# EAGLE schematic untitled (EAGLE 7.2.0)
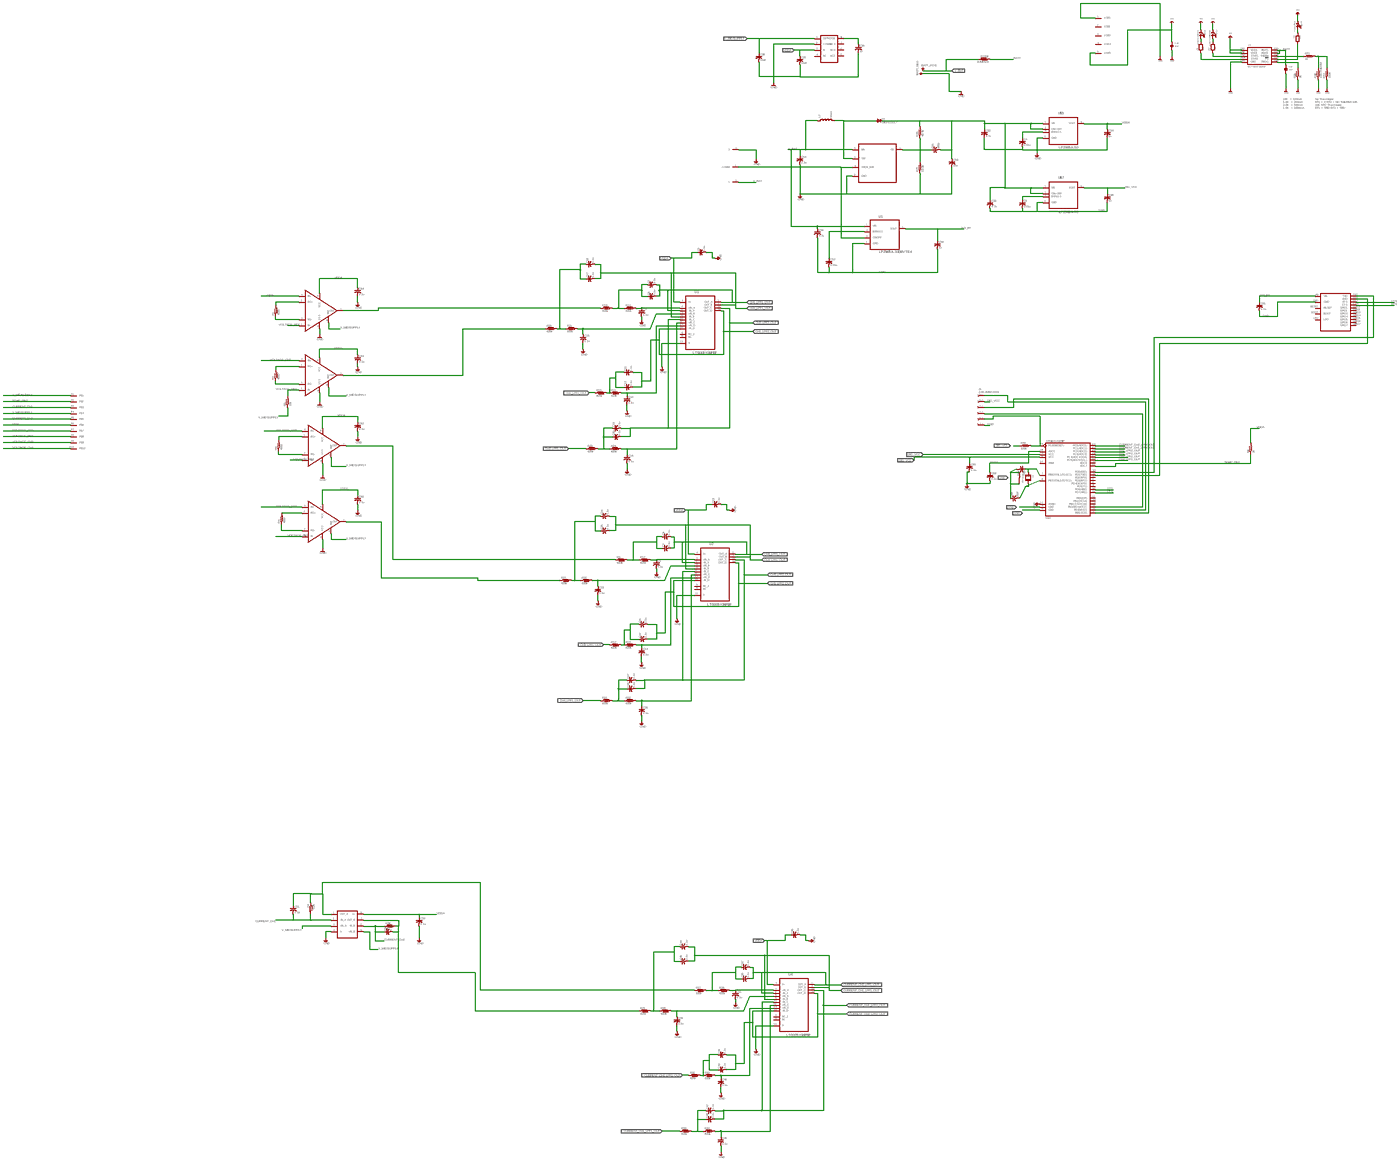
[diagram p0: schematic, sheet 1, overview]
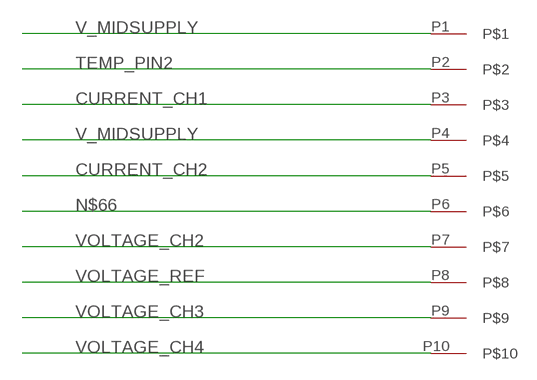
[diagram p1: schematic, sheet 1, part 1 of 7]
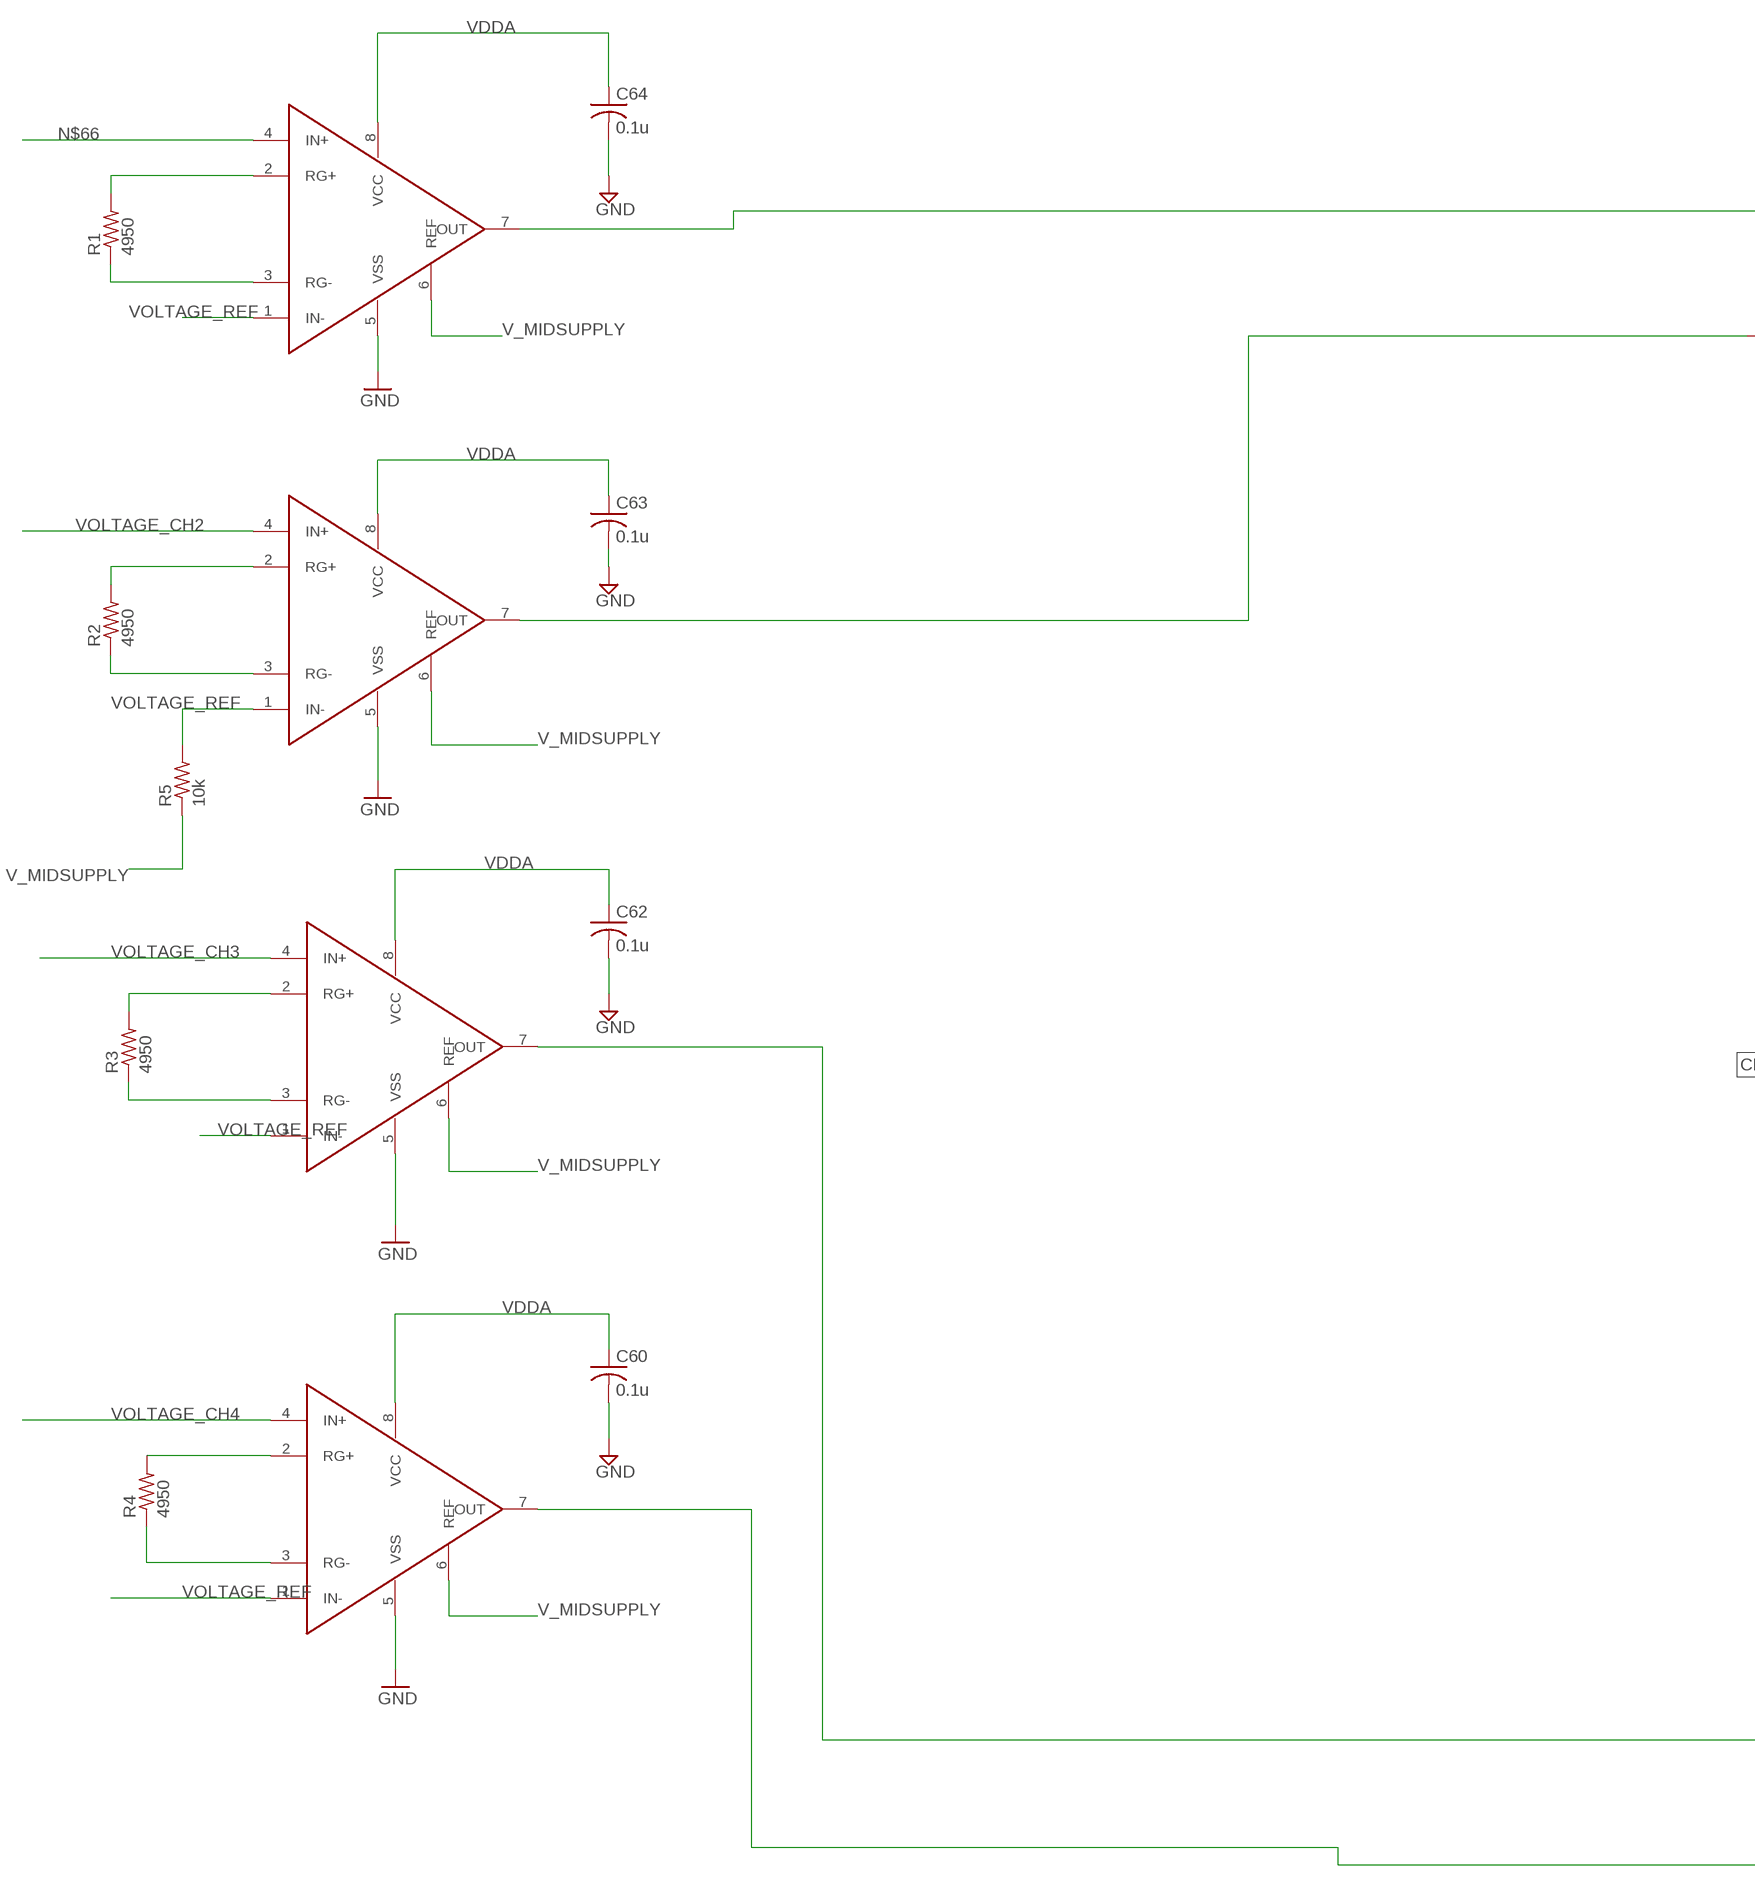
[diagram p2: schematic, sheet 1, part 2 of 7]
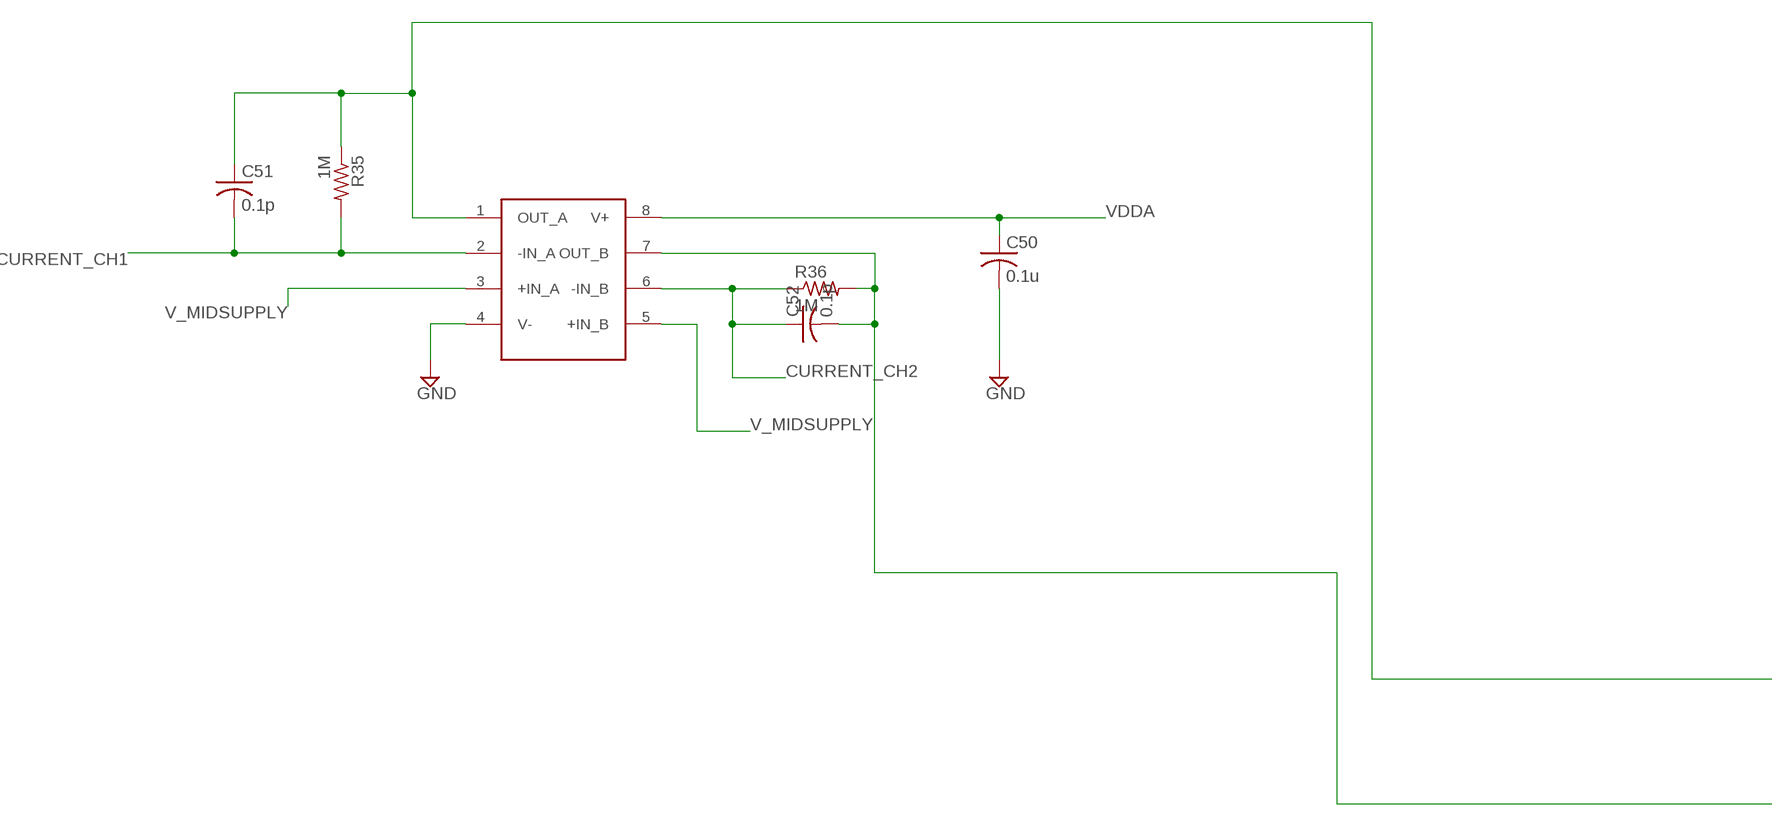
[diagram p3: schematic, sheet 1, part 3 of 7]
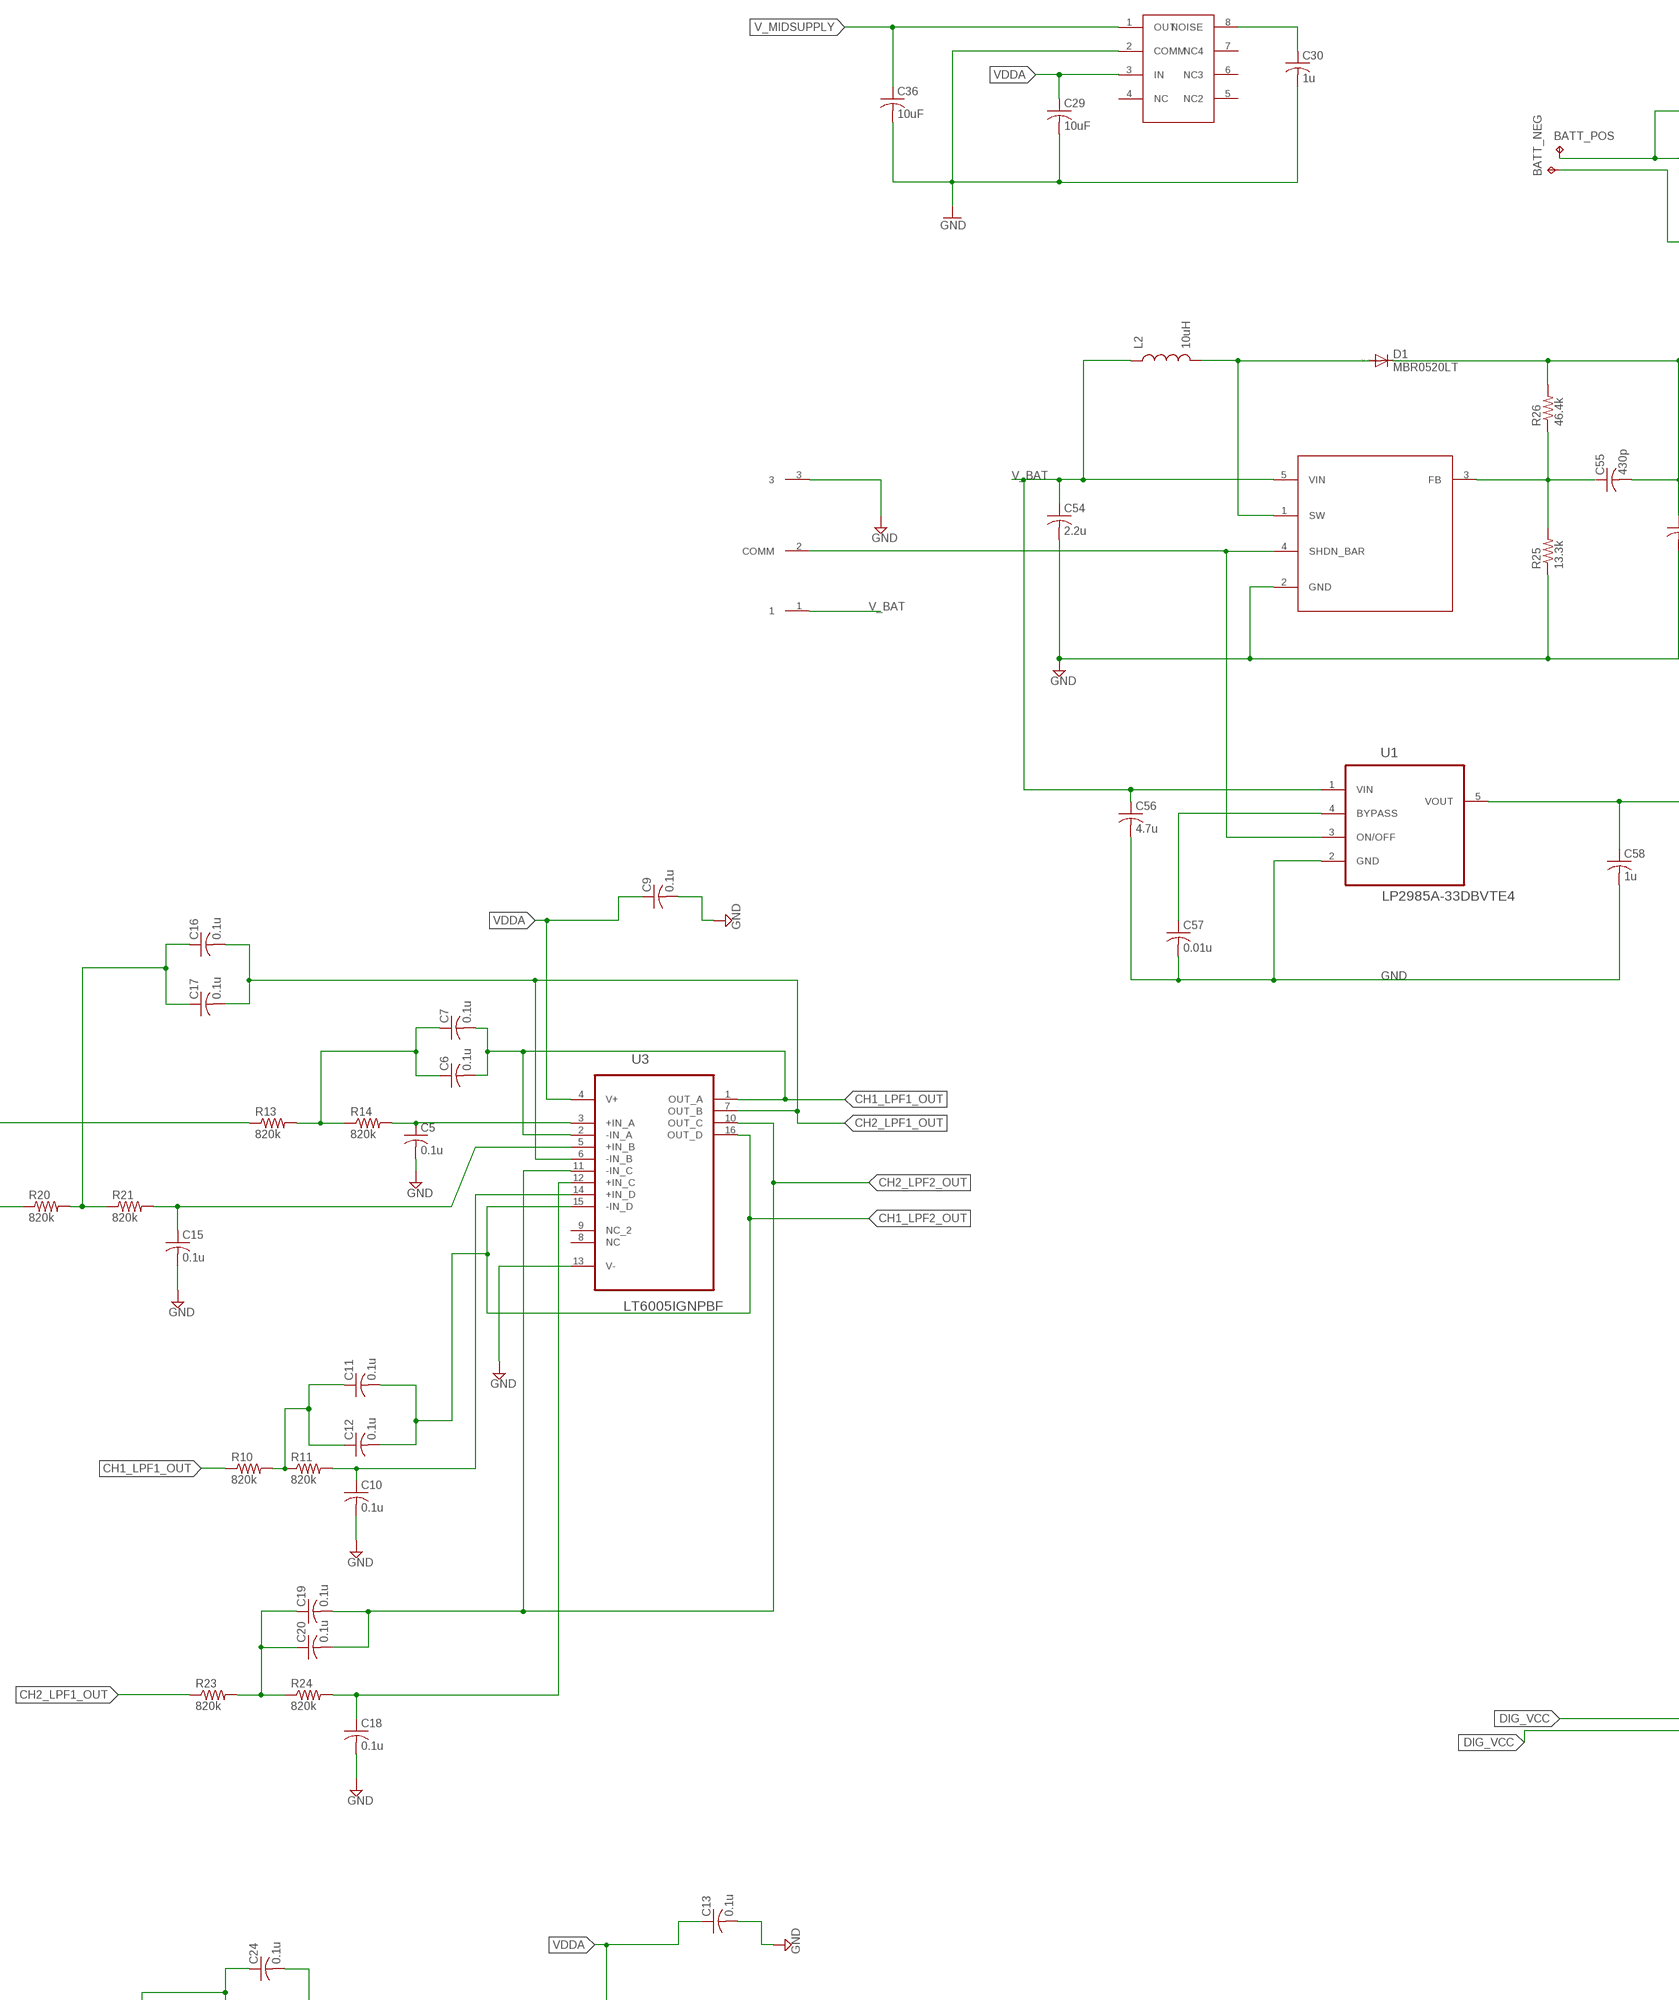
[diagram p4: schematic, sheet 1, part 4 of 7]
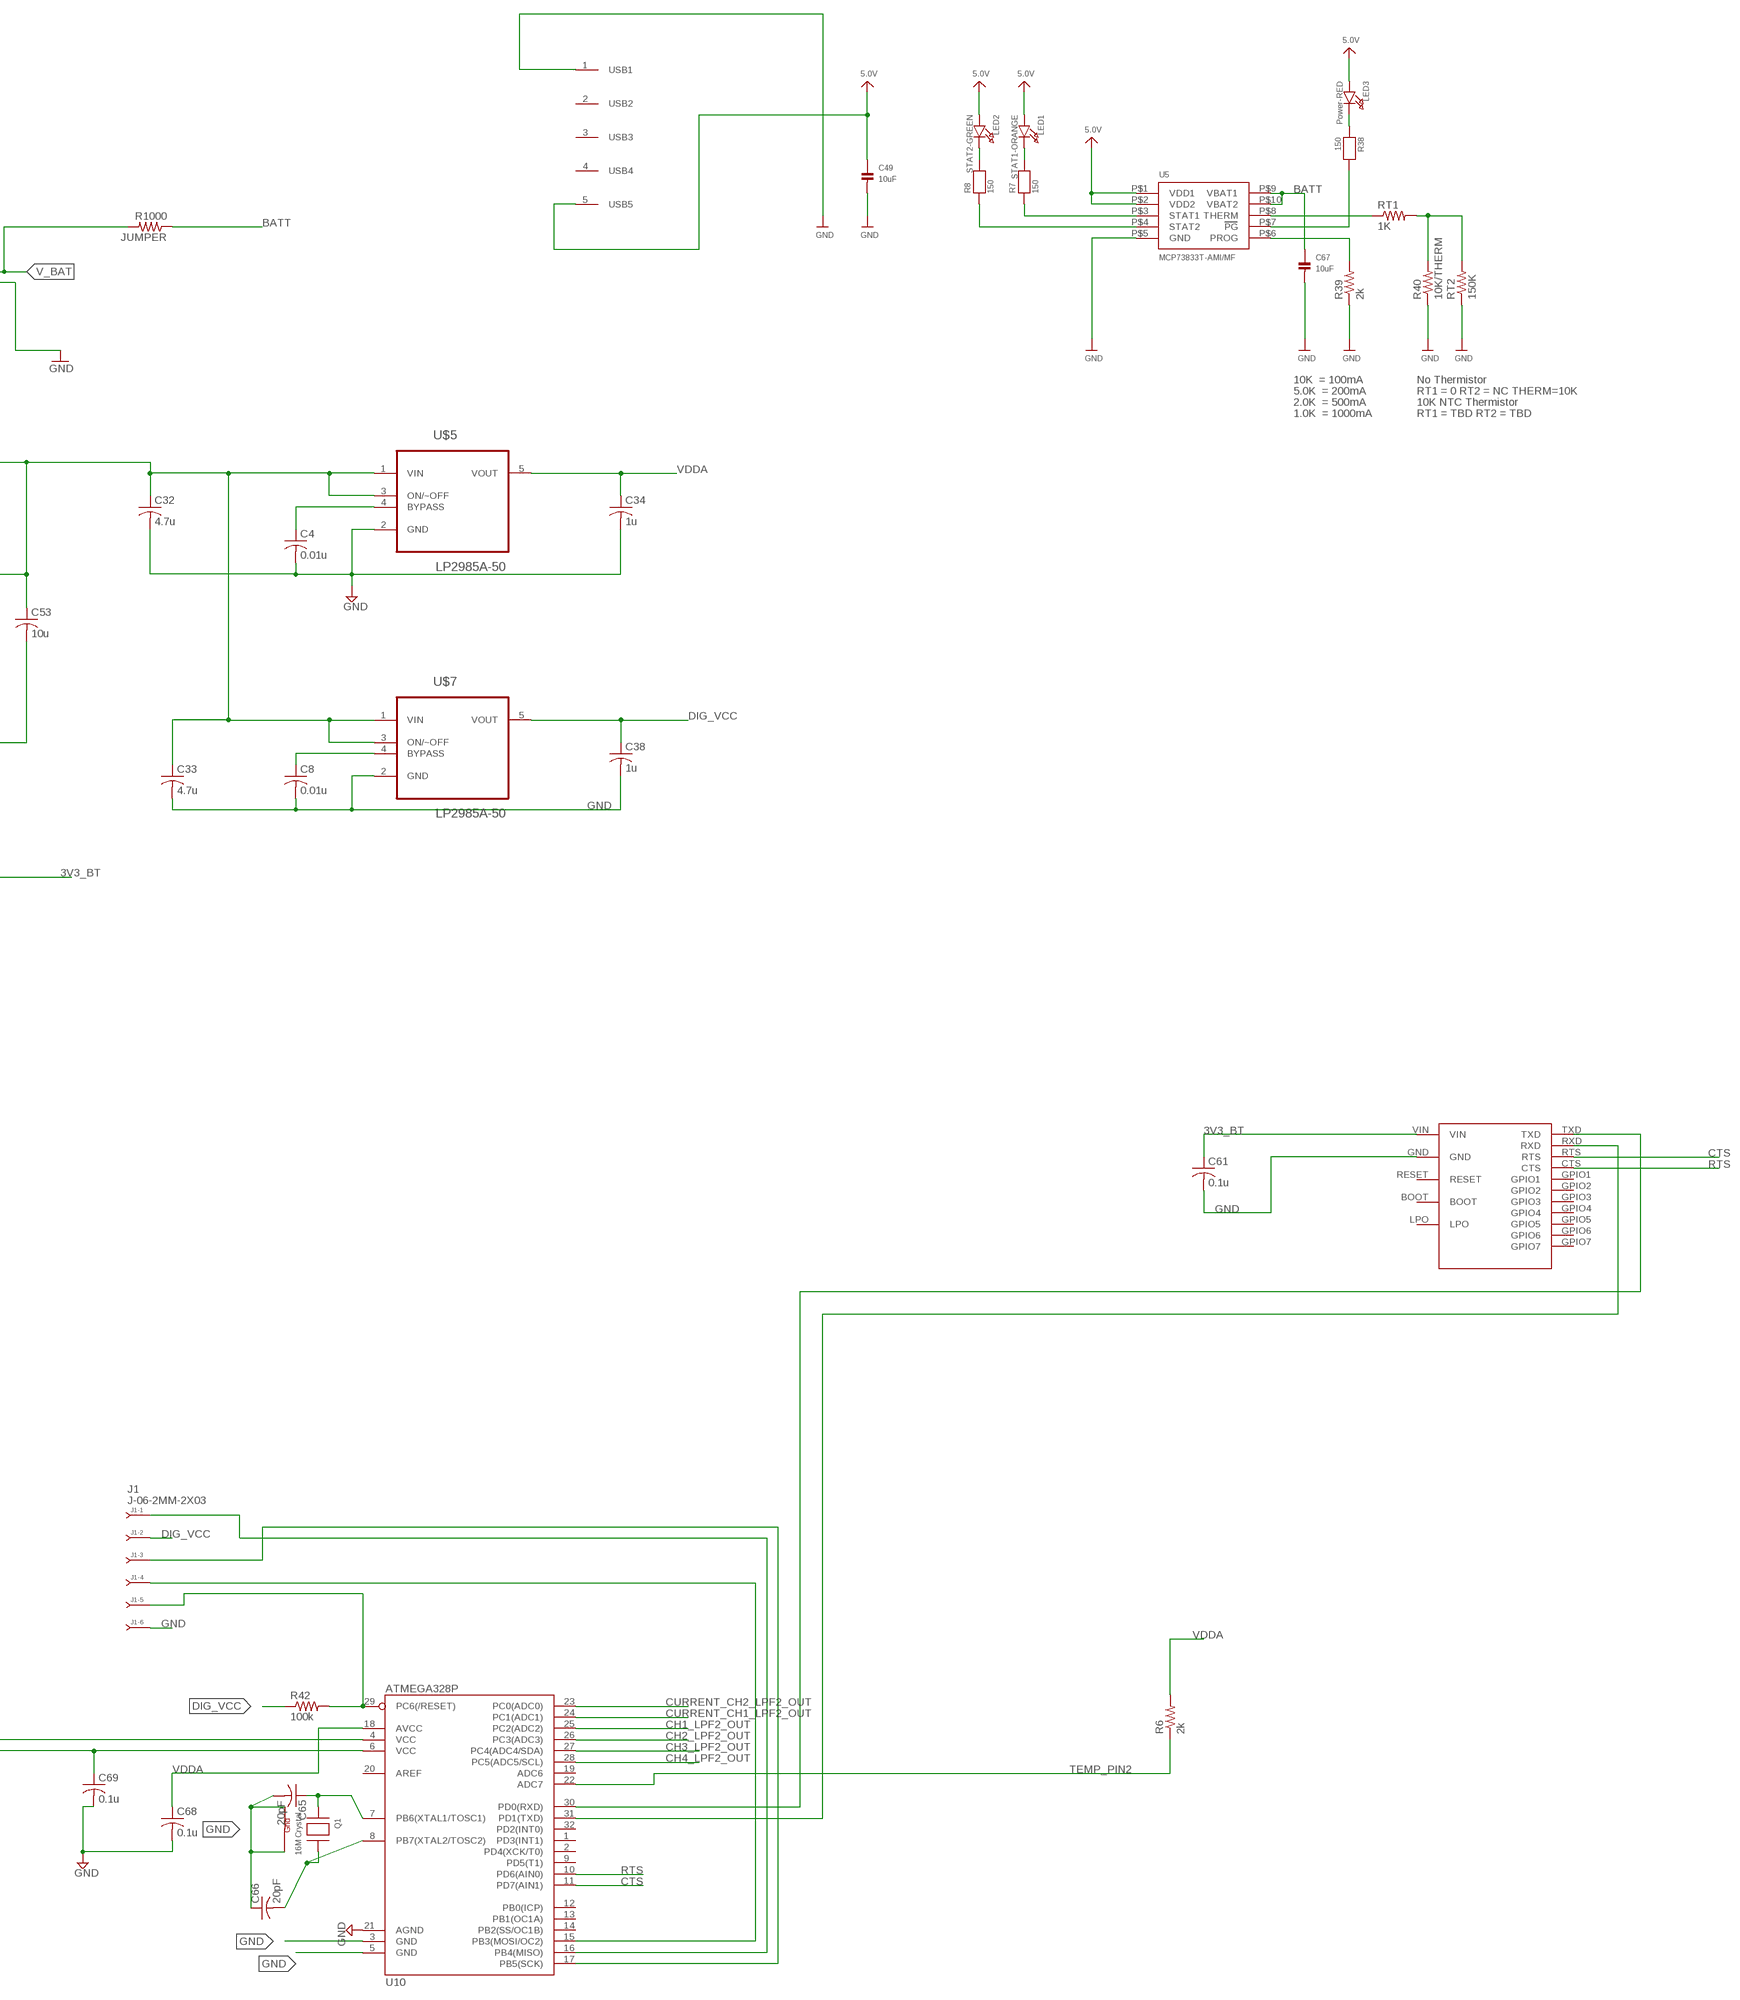
[diagram p5: schematic, sheet 1, part 5 of 7]
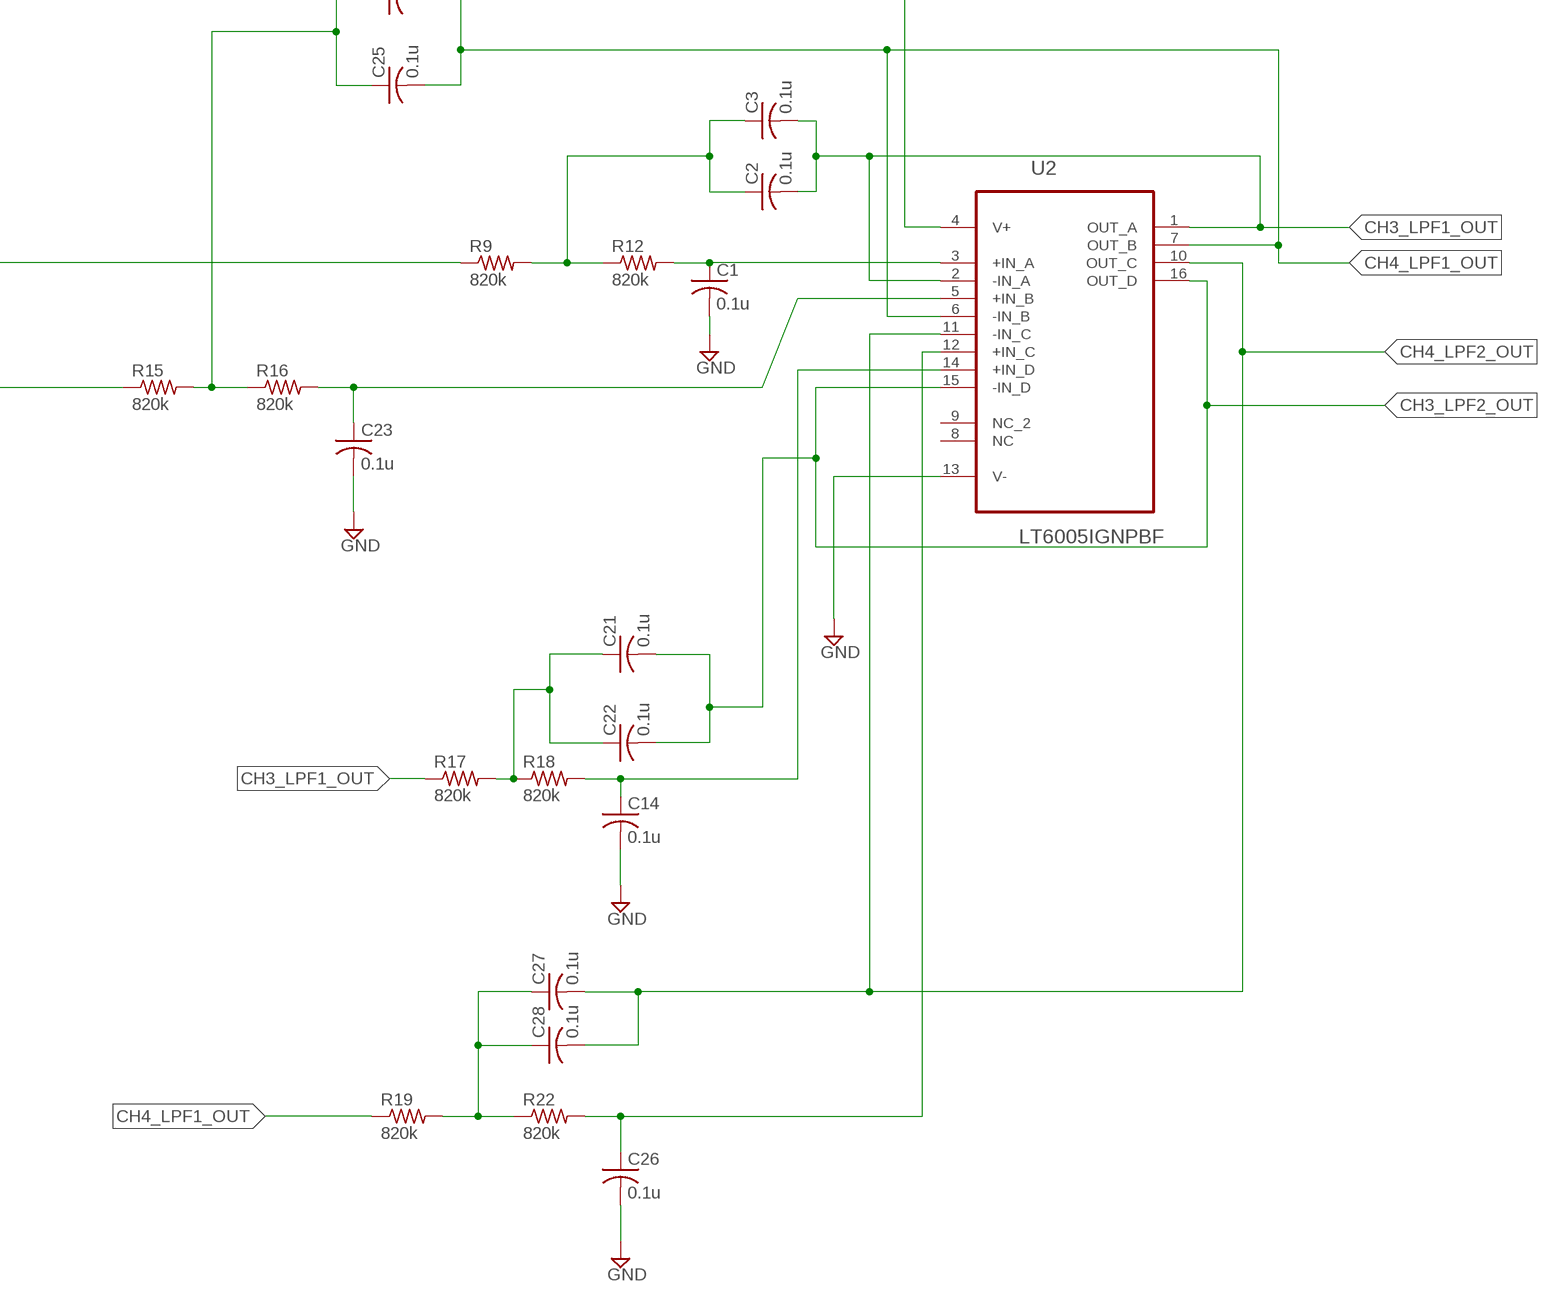
[diagram p6: schematic, sheet 1, part 6 of 7]
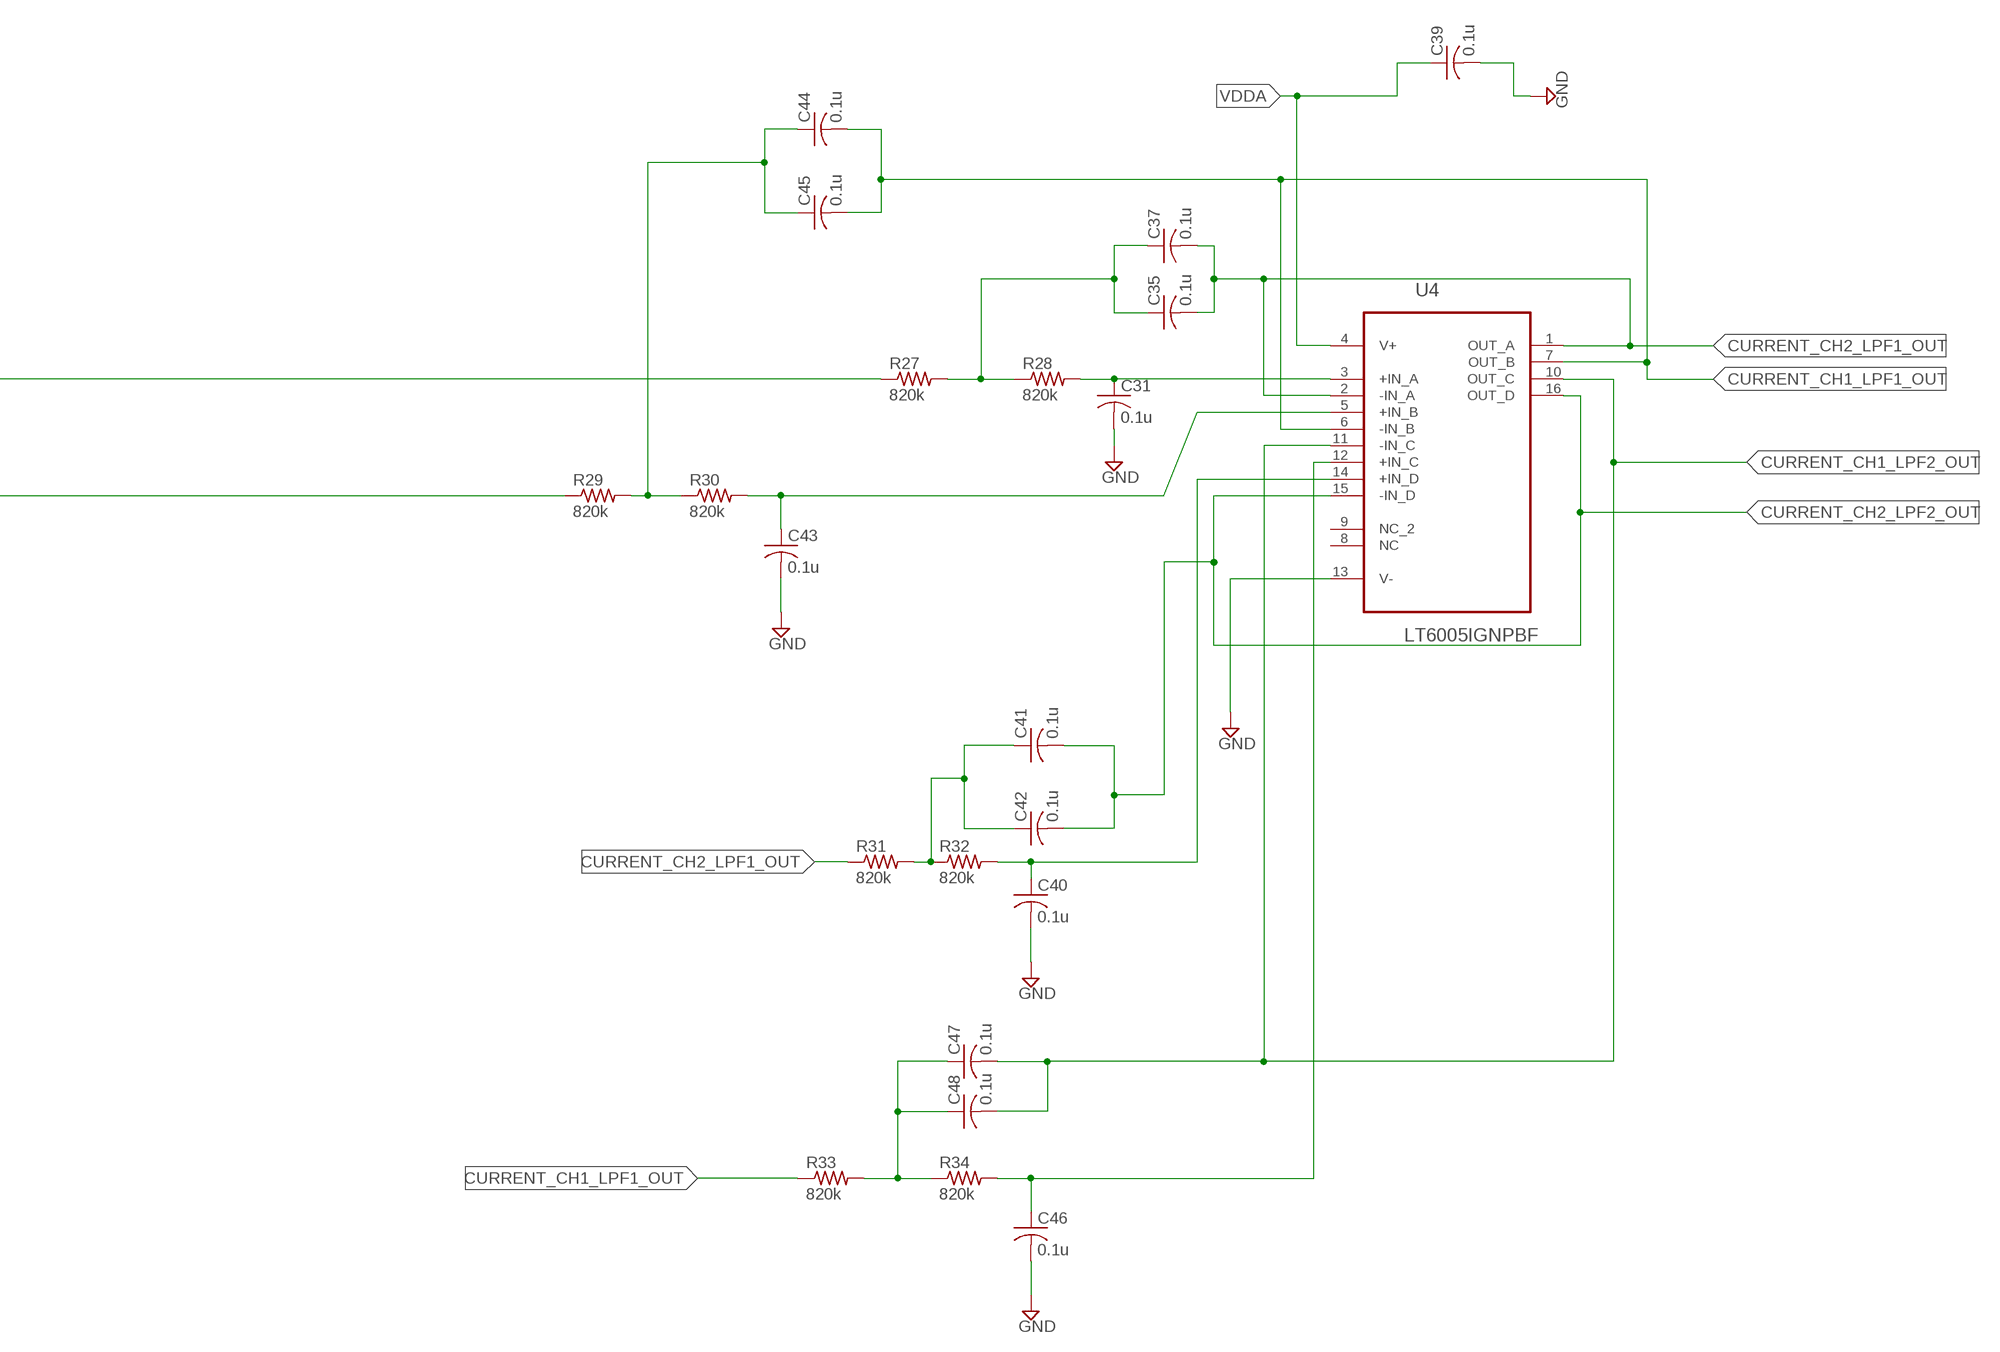
[diagram p7: schematic, sheet 1, part 7 of 7]

## Parts
BATT_NEG  TPTP14R  [TP14R]
BATT_POS  TPTP14R  [TP14R]
C1  0.1u  C-USC0201  [C0201]
C2  0.1u  C-USC0201  [C0201]
C3  0.1u  C-USC0201  [C0201]
C4  0.01u  C-USC0402  [C0402]
C5  0.1u  C-USC0201  [C0201]
C6  0.1u  C-USC0201  [C0201]
C7  0.1u  C-USC0201  [C0201]
C8  0.01u  C-USC0402  [C0402]
C9  0.1u  C-USC0201  [C0201]
C10  0.1u  C-USC0201  [C0201]
C11  0.1u  C-USC0201  [C0201]
C12  0.1u  C-USC0201  [C0201]
C13  0.1u  C-USC0201  [C0201]
C14  0.1u  C-USC0201  [C0201]
C15  0.1u  C-USC0201  [C0201]
C16  0.1u  C-USC0201  [C0201]
C17  0.1u  C-USC0201  [C0201]
C18  0.1u  C-USC0201  [C0201]
C19  0.1u  C-USC0201  [C0201]
C20  0.1u  C-USC0201  [C0201]
C21  0.1u  C-USC0201  [C0201]
C22  0.1u  C-USC0201  [C0201]
C23  0.1u  C-USC0201  [C0201]
C24  0.1u  C-USC0201  [C0201]
C25  0.1u  C-USC0201  [C0201]
C26  0.1u  C-USC0201  [C0201]
C27  0.1u  C-USC0201  [C0201]
C28  0.1u  C-USC0201  [C0201]
C29  10uF  C-USC0402  [C0402]
C30  1u  C-USC0402  [C0402]
C31  0.1u  C-USC0201  [C0201]
C32  4.7u  C-USC0402  [C0402]
C33  4.7u  C-USC0402  [C0402]
C34  1u  C-USC0402  [C0402]
C35  0.1u  C-USC0201  [C0201]
C36  10uF  C-USC0402  [C0402]
C37  0.1u  C-USC0201  [C0201]
C38  1u  C-USC0402  [C0402]
C39  0.1u  C-USC0201  [C0201]
C40  0.1u  C-USC0201  [C0201]
C41  0.1u  C-USC0201  [C0201]
C42  0.1u  C-USC0201  [C0201]
C43  0.1u  C-USC0201  [C0201]
C44  0.1u  C-USC0201  [C0201]
C45  0.1u  C-USC0201  [C0201]
C46  0.1u  C-USC0201  [C0201]
C47  0.1u  C-USC0201  [C0201]
C48  0.1u  C-USC0201  [C0201]
C49  10uF  CAP_CERAMIC0402  [0402]
C50  0.1u  C-USC0201  [C0201]
C51  0.1p  C-USC0201  [C0201]
C52  0.1p  C-USC0201  [C0201]
C53  10u  C-USC0402  [C0402]
C54  2.2u  C-USC0402  [C0402]
C55  430p  C-USC0402  [C0402]
C56  4.7u  C-USC0402  [C0402]
C57  0.01u  C-USC0402  [C0402]
C58  1u  C-USC0402  [C0402]
C60  0.1u  C-USC0201  [C0201]
C61  0.1u  C-USC0402  [C0402]
C62  0.1u  C-USC0201  [C0201]
C63  0.1u  C-USC0201  [C0201]
C64  0.1u  C-USC0201  [C0201]
C65  20pF  C-USC0402  [C0402]
C66  20pF  C-USC0402  [C0402]
C67  10uF  CAP_CERAMIC0402  [0402]
C68  0.1u  C-USC0201  [C0201]
C69  0.1u  C-USC0201  [C0201]
D1  MBR0520LT  [SOD123]
J1  J-06-2MM-2X03  [DIL-2MM-2X03]
JUMPER  R1000  R-US_R0402  [R0402]
L2  10uH  INDUCTOR0805  [0805]
LED1  STAT1-ORANGE  LED0805  [CHIPLED_0805]
LED2  STAT2-GREEN  LED0805  [CHIPLED_0805]
LED3  Power-RED  LED0805  [CHIPLED_0805]
Q1  16M Crystal  XTAL-4-3225  [NX3225]
R1  4950  R-US_R0201  [R0201]
R2  4950  R-US_R0201  [R0201]
R3  4950  R-US_R0201  [R0201]
R4  4950  R-US_R0201  [R0201]
R5  10k  R-US_R0402  [R0402]
R6  2k  R-US_R0402  [R0402]
R7  150  RESISTOR0402  [0402]
R8  150  RESISTOR0402  [0402]
R9  820k  R-US_R0201  [R0201]
R10  820k  R-US_R0201  [R0201]
R11  820k  R-US_R0201  [R0201]
R12  820k  R-US_R0201  [R0201]
R13  820k  R-US_R0201  [R0201]
R14  820k  R-US_R0201  [R0201]
R15  820k  R-US_R0201  [R0201]
R16  820k  R-US_R0201  [R0201]
R17  820k  R-US_R0201  [R0201]
R18  820k  R-US_R0201  [R0201]
R19  820k  R-US_R0201  [R0201]
R20  820k  R-US_R0201  [R0201]
R21  820k  R-US_R0201  [R0201]
R22  820k  R-US_R0201  [R0201]
R23  820k  R-US_R0201  [R0201]
R24  820k  R-US_R0201  [R0201]
R25  13.3k  R-US_R0402  [R0402]
R26  46.4k  R-US_R0402  [R0402]
R27  820k  R-US_R0201  [R0201]
R28  820k  R-US_R0201  [R0201]
R29  820k  R-US_R0201  [R0201]
R30  820k  R-US_R0201  [R0201]
R31  820k  R-US_R0201  [R0201]
R32  820k  R-US_R0201  [R0201]
R33  820k  R-US_R0201  [R0201]
R34  820k  R-US_R0201  [R0201]
R35  1M  R-US_R0201  [R0201]
R36  1M  R-US_R0201  [R0201]
R38  150  RESISTOR0402  [0402]
R39  2k  R-US_R0402  [R0402]
R40  10K/THERM  R-US_R0402  [R0402]
R42  100k  R-US_R0201  [R0201]
RT1  1K  R-US_R0402  [R0402]
RT2  150K  R-US_R0402  [R0402]
U1  LP2985A-33DBVTE4  [SOT95P280X145-5N]
U2  LT6005IGNPBF  [SOP63P600X175-16N]
U3  LT6005IGNPBF  [SOP63P600X175-16N]
U4  LT6005IGNPBF  [SOP63P600X175-16N]
U5  MCP73833T-AMI/MF  MCP73833DFN  [DFN10_3X3MM]
U10  ATMEGA328P  ATMEGA328_SMT  [TQFP32-08]
U15  TLE2426IDR  [R_8]
U$1  SOIC8_INAMPMSOP  [MSOP08]
U$2  SOIC8_INAMPMSOP  [MSOP08]
U$3  SOIC8_INAMPMSOP  [MSOP08]
U$4  SOIC8_INAMPMSOP  [MSOP08]
U$5  LP2985A-50  [SOT95P280X145-5N]
U$6  AD8462  [MSOP08]
U$7  LP2985A-50  [SOT95P280X145-5N]
U$8  SPBT2632C2A  [SPBT2632C2A]
U$9  LM27313  [SOT95P280X145-5N]
U$10  MINI-USB-10033526-N3212LF  [MINI-USB-10033526-N3212LF]
U$11  JS102011SAQN  [JS102011SAQN]
U$12  5-104074-1-CONNECTOR  [5-104074-1-CONNECTOR]

## Nets
3V3_BT: C58.1 C61.1 U1.5(VOUT) U$8.VIN
5.0V: C49.1 LED1.A LED2.A LED3.A U5.P$1(VDD1) U5.P$2(VDD2) U$10.5(USB5)
BATT: C67.1 JUMPER.1 U5.P$9(VBAT1) U5.P$10(VBAT2)
CH1_LPF1_OUT: C6.2 C7.2 R10.1 U3.1(OUT_A) U3.2(-IN_A)
CH1_LPF2_OUT: C11.2 C12.2 U3.15(-IN_D) U3.16(OUT_D) U10.25(PC2(ADC2))
CH2_LPF1_OUT: C16.2 C17.2 R23.1 U3.6(-IN_B) U3.7(OUT_B)
CH2_LPF2_OUT: C19.2 C20.2 U3.10(OUT_C) U3.11(-IN_C) U10.26(PC3(ADC3))
CH3_LPF1_OUT: C2.2 C3.2 R17.1 U2.1(OUT_A) U2.2(-IN_A)
CH3_LPF2_OUT: C21.2 C22.2 U2.15(-IN_D) U2.16(OUT_D) U10.27(PC4(ADC4/SDA))
CH4_LPF1_OUT: C24.2 C25.2 R19.1 U2.6(-IN_B) U2.7(OUT_B)
CH4_LPF2_OUT: C27.2 C28.2 U2.10(OUT_C) U2.11(-IN_C) U10.28(PC5(ADC5/SCL))
CTS: U10.11(PD7(AIN1)) U$8.RTS
CURRENT_CH1: C51.2 R35.2 U$6.2(-IN_A) U$12.P3
CURRENT_CH1_LPF1_OUT: C44.2 C45.2 R33.1 U4.6(-IN_B) U4.7(OUT_B)
CURRENT_CH1_LPF2_OUT: C47.2 C48.2 U4.10(OUT_C) U4.11(-IN_C) U10.24(PC1(ADC1))
CURRENT_CH2: C52.1 R36.1 U$6.6(-IN_B) U$12.P5
CURRENT_CH2_LPF1_OUT: C35.2 C37.2 R31.1 U4.1(OUT_A) U4.2(-IN_A)
CURRENT_CH2_LPF2_OUT: C41.2 C42.2 U4.15(-IN_D) U4.16(OUT_D) U10.23(PC0(ADC0))
DIG_VCC: C38.1 C69.1 J1.2 R42.1 U10.4(VCC) U10.6(VCC) U$7.5(VOUT)
GND: BATT_NEG.TP C1.2 C4.2 C5.2 C8.2 C9.2 C10.2 C13.2 C14.2 C15.2 C18.2 C23.2 C26.2 C29.2 C30.2 C31.2 C32.2 C33.2 C34.2 C36.2 C38.2 C39.2 C40.2 C43.2 C46.2 C49.2 C50.2 C53.2 C54.2 C56.2 C57.2 C58.2 C60.2 C61.2 C62.2 C63.2 C64.2 C65.2 C66.1 C67.2 C68.2 C69.2 J1.6 Q1.2(G2) Q1.4(G1) R25.1 R39.1 R40.1 RT2.1 U1.2(GND) U2.13(V-) U3.13(V-) U4.13(V-) U5.P$5(GND) U10.3(GND) U10.5(GND) U10.21(AGND) U15.2(COMM) U$1.5(VSS) U$2.5(VSS) U$3.5(VSS) U$4.5(VSS) U$5.2(GND) U$6.4(V-) U$7.2(GND) U$8.GND U$9.2(GND) U$10.1(USB1) U$11.3
N$1: R3.1 U$3.3(RG-)
N$2: R3.2 U$3.2(RG+)
N$3: R2.2 U$2.2(RG+)
N$4: R2.1 U$2.3(RG-)
N$5: R1.2 U$1.2(RG+)
N$6: R1.1 U$1.3(RG-)
N$7: R4.2 U$4.2(RG+)
N$8: R4.1 U$4.3(RG-)
N$10: LED1.C R7.2
N$11: LED2.C R8.2
N$12: R7.1 U5.P$3(STAT1)
N$13: C5.1 R14.2 U3.3(+IN_A)
N$14: C10.1 R11.2 U3.14(+IN_D)
N$15: C6.1 C7.1 R13.2 R14.1
N$16: R20.1 U$2.7(OUT)
N$17: C11.1 C12.1 R10.2 R11.1
N$18: R13.1 U$1.7(OUT)
N$19: C1.1 R12.2 U2.3(+IN_A)
N$20: C2.1 C3.1 R9.2 R12.1
N$21: C14.1 R18.2 U2.14(+IN_D)
N$22: C21.1 C22.1 R17.2 R18.1
N$23: C23.1 R16.2 U2.5(+IN_B)
N$24: C15.1 R21.2 U3.5(+IN_B)
N$25: C16.1 C17.1 R20.2 R21.1
N$26: C18.1 R24.2 U3.12(+IN_C)
N$27: C19.1 C20.1 R23.2 R24.1
N$28: C24.1 C25.1 R15.2 R16.1
N$29: C26.1 R22.2 U2.12(+IN_C)
N$30: C27.1 C28.1 R19.2 R22.1
N$31: R15.1 U$4.7(OUT)
N$32: R9.1 U$3.7(OUT)
N$33: C30.1 U15.8(NOISE)
N$34: C32.1 C33.1 C53.1 C55.2 D1.C R26.2 U$5.1(VIN) U$5.3(ON/~OFF) U$7.1(VIN) U$7.3(ON/~OFF)
N$35: J1.5 R42.2 U10.29(PC6(/RESET))
N$36: C4.1 U$5.4(BYPASS)
N$37: C65.1 Q1.1(X1) U10.7(PB6(XTAL1/TOSC1))
N$38: C66.2 Q1.3(X2) U10.8(PB7(XTAL2/TOSC2))
N$39: J1.3 U10.17(PB5(SCK))
N$40: J1.1 U10.16(PB4(MISO))
N$41: J1.4 U10.15(PB3(MOSI/OC2))
N$42: U10.30(PD0(RXD)) U$8.TXD
N$43: D1.A L2.2 U$9.1(SW)
N$44: C8.1 U$7.4(BYPASS)
N$45: C31.1 R28.2 U4.3(+IN_A)
N$46: C35.1 C37.1 R27.2 R28.1
N$47: C40.1 R32.2 U4.14(+IN_D)
N$48: C41.1 C42.1 R31.2 R32.1
N$49: C55.1 R25.2 R26.1 U$9.3(FB)
N$50: C43.1 R30.2 U4.5(+IN_B)
N$51: C44.1 C45.1 R29.2 R30.1
N$52: R8.1 U5.P$4(STAT2)
N$53: C46.1 R34.2 U4.12(+IN_C)
N$54: C47.1 C48.1 R33.2 R34.1
N$55: U10.31(PD1(TXD)) U$8.RXD
N$56: C51.1 R27.1 R35.1 U$6.1(OUT_A)
N$57: C52.2 R29.1 R36.2 U$6.7(OUT_B)
N$58: C57.1 U1.4(BYPASS)
N$59: LED3.C R38.1
N$60: R39.2 U5.P$6(PROG)
N$61: R38.2 U5.P$7(PG)
N$62: RT1.1 U5.P$8(THERM)
N$63: R40.2 RT1.2 RT2.2
N$64: U1.3(ON/OFF) U$9.4(SHDN_BAR) U$11.2(COMM)
N$66: U$1.4(IN+) U$12.P6
RTS: U10.10(PD6(AIN0)) U$8.CTS
TEMP_PIN2: R6.1 U10.22(ADC7) U$12.P2
V_BAT: BATT_POS.TP C54.1 C56.1 JUMPER.2 L2.1 U1.1(VIN) U$9.5(VIN) U$11.1
V_MIDSUPPLY: C36.1 R5.1 U15.1(OUT) U$1.6(REF) U$2.6(REF) U$3.6(REF) U$4.6(REF) U$6.3(+IN_A) U$6.5(+IN_B) U$12.P1 U$12.P4
VDDA: C9.1 C13.1 C29.1 C34.1 C39.1 C50.1 C60.1 C62.1 C63.1 C64.1 C68.1 R6.2 U2.4(V+) U3.4(V+) U4.4(V+) U10.18(AVCC) U15.3(IN) U$1.8(VCC) U$2.8(VCC) U$3.8(VCC) U$4.8(VCC) U$5.5(VOUT) U$6.8(V+)
VOLTAGE_CH2: U$2.4(IN+) U$12.P7
VOLTAGE_CH3: U$3.4(IN+) U$12.P9
VOLTAGE_CH4: U$4.4(IN+) U$12.P10
VOLTAGE_REF: R5.2 U$1.1(IN-) U$2.1(IN-) U$3.1(IN-) U$4.1(IN-) U$12.P8
Unconnected: U2.8(NC) U2.9(NC_2) U3.8(NC) U3.9(NC_2) U4.8(NC) U4.9(NC_2) U10.1(PD3(INT1)) U10.2(PD4(XCK/T0)) U10.9(PD5(T1)) U10.12(PB0(ICP)) U10.13(PB1(OC1A)) U10.14(PB2(SS/OC1B)) U10.19(ADC6) U10.20(AREF) U10.32(PD2(INT0)) U15.4(NC) U15.5(NC2) U15.6(NC3) U15.7(NC4) U$8.BOOT U$8.GPIO1 U$8.GPIO2 U$8.GPIO3 U$8.GPIO4 U$8.GPIO5 U$8.GPIO6 U$8.GPIO7 U$8.LPO U$8.RESET U$10.2(USB2) U$10.3(USB3) U$10.4(USB4)

## Notes on the sheet
- 10K  = 100mA | No Thermistor
- 5.0K  = 200mA | RT1 = 0 RT2 = NC THERM=10K
- 2.0K  = 500mA | 10K NTC Thermistor
- 1.0K  = 1000mA | RT1 = TBD RT2 = TBD

## Library data of the parts
BATT_NEG BATT_POS = testpad:TP: Test pad
C1-C28 C31-C35 C37-C48 C50-C58 C60-C64 C68 C69 = resistor:C-US: CAPACITOR, American symbol
C29 C30 C36 C65 C66 = adafruit:C-US: CAPACITOR, American symbol; OC_NEWARK: unknown
C49 C67 = microbuilder:CAP_CERAMIC: Ceramic Capacitors 0402 - 0402 Surface Mount Capacitors 16pF 50V 5% [Digikey: 445-4899-2-ND] 18pF 50V 5% [Digikey: 490-1281-2-ND] 22pF 50V 5% [Digikey: 490-1283-2-ND] 68pF 50V 5% [Digikey: 490-1289-2-ND] 0.1uF 10V 10% [Digikey: 490-1318-2-ND] 1.0uF 6.3V 10% [Digikey: 490-1320-2-ND] 0603 - 0603 Surface Mount Capacitors 16 pF 50V 5% [Digikey: 445-5051-2-ND] 22 pF 50V [Digikey: PCC220ACVTR-ND] 33 pF 50V 5% [Digikey: 490-1415-1-ND] 56pF 50V 5% [Digikey: 490-1421-1-ND] 220pF 50V 5% [Digikey: 445-1285-1-ND] 680 pF 50V 2200 pF 50V 5% C0G [Digikey: 445-1297-1-ND] 5600 pF 100V 5% X7R [Digikey: 478-3711-1-ND] 0.1 µF 25V 10% [Digikey: PCC2277TR-ND] 0.22 µF 16V 10% X7R [Digikey: 445-1318-1-ND] 1.0 µF 25V 10% [Digikey: 445-5146-2-ND] 0603 - RF Specific 3pF 250V +/-0.1pF RF [Digikey: 712-1347-1-ND] 18 pF 250V 5% [Digikey: 478-3505-1-ND or 712-1322-1-ND] 56 pF 250V 5% C0G RF [Digikey: 490-4867-1-ND] 68 pF 250V RF [Digikey: 490-4868-1-ND] 0805 - 0805 Surface Mount Capacitors 220 pF 250V 2% RF Ceramic Capacitor [Digikey: 712-1398-1-ND] 1000 pF 50V 2% NP0 Ceramic Capacitor [Digikey: 478-3760-1-ND] 0.1 µF 25V 10% Ceramic Capacitor [Digikey: PCC1828TR-ND] 1.0 µF 16V 10% Ceramic Capacitor[Digikey: 490-1691-2-ND] 10.0 µF 10V 10% Ceramic Capacitor[Digikey: 709-1228-1-ND] 10.0 uF 16V 10% Ceramic Capacitor [Digikey: 478-5165-2-ND] 47 uF 6.3V 20% Ceramic Capacitor [Digikey: 399-5506-1-ND] 1206 - 1206 Surface Mount Capacitors 47uF 10V 20% Ceramic Capacitor [Digikey: 399-5508-1-ND]
D1 = diode:MBR0520LT: SCHOTTKY BARRIER RECTIFIER Source: http://onsemi.com .. MBR0520LT1-D.pdf
J1 = con-headers-jp:J-06-: HEADER JACK PINS
JUMPER R1-R6 R9-R36 R42 = resistor:R-US_: RESISTOR, American symbol
L2 = SparkFun-Passives:INDUCTOR: Inductors Basic Inductor/Choke - 0603 and 1206. Footprints are not proven and vary greatly between part numbers. SRN6045- 33uH, 20% 1.4A SDR0403-560KL - 56uH, 10%, 500mA RMS/740mA peak; OC_NEWARK: unknown
LED1-LED3 = microbuilder:LED: LED 0603 - 0603 Surface Mount Package 2mA: Green LED - Low Power (3.9mcd, 2ma, 1.7Vf) - Digikey: 475-2709-2-ND Orange LED - Low Power (9.8mcd, 2ma, 1.8Vf) - Digikey: 475-1194-2-ND Red LED - Low Power (5mcd, 2ma, 1.8Vf) - Digikey: 475-1195-2-ND Yellow LED - Low Power (7mcd, 2ma, 1.8Vf) - Digikey: 475-1196-2-ND 5mA: Blue LED - Low Power (17mcd, 5ma, 2.9Vf) - Digikey: LNJ937W8CRACT-ND 0805 - 0805 Surface Mount Package 2mA: Red LED (8.8mcd, 2mA, 1.8Vf, Clear) - Low Power [Digikey: 475-2510-1-ND] Green LED (5mcd, 2mA, 1.8Vf, Clear) - Low Power [Digikey: 475-2730-1-ND] Yellow LED (11.3mcd, 2mA, 1.8Vf, Clear) - Low Power [Digikey: 475-2555-1-ND] 20mA: Red LED (104mcd, 20mA, Diffused) - LS R976 [Digikey: 475-1278-6-ND] Red LED (12mcd, 20mA, 2.0Vf, Clear) - APT2012EC [Digikey: 754-1128-1-ND] Green LED (15mcd, 20mA, 2.2Vf, Clear) - APT2012GC [Digikey: 754-1131-1-ND] Orange LED (160mcd, 20mA, 2.1Vf, Clear) - APT2012SECK [Digikey: 754-1130-1-ND] 1206 - 1206 Surface Mount Package Green LED (26mcd, 20mA, Diffused) - LG N971 [Digikey: 475-1407-6-ND] Red LED (15mcd, 20mA, Diffused) - LH N974 [Digikey: 475-1416-6-ND]
Q1 = adafruit:XTAL-4: Classic 4-pin 3.2 x 2.5mm crystal; OC_NEWARK: unknown
R7 R8 R38 = microbuilder:RESISTOR: Resistors 0402 - 0402 Surface Mount Package 22 Ohm 1% 1/16W [Digikey: 311-22.0LRTR-ND] 33 Ohm 5% 1/16W 1.0K 5% 1/16W 1.5K 5% 1/16W 2.0K 1% 1/16W 10.0K 1% 1/16W [Digikey: 311-10.0KLRTR-ND] 10.0K 5% 1/16W [Digikey: RMCF0402JT10K0TR-ND] 12.1K 1% 1/16W [Digikey: 311-22.0LRTR-ND] 100.0K 5% 1/16W 0603 - 0603 Surface Mount Package 0 Ohm 1/10 Watt 1% Resistor 15 Ohm 1/10 Watt 1% Resistor 33 Ohm 1/10 Watt 1% Resistor 49.9 Ohm 1/10 Watt 1% Resistor 100 Ohm 1/10 Watt 1% Resistor 150 Ohm 1/10 Watt 1% Resistor 240 Ohm 1/10 Watt 1% Resistor 390 Ohm 1/10 Watt 1% Resistor 560 Ohm 1/10 Watt 1% Resistor 680 Ohm 1/10 Watt 1% Resistor 750 Ohm 1/10 Watt 1% Resistor 1.0K Ohm 1/10 Watt 1% Resistor 1.5K Ohm 1/10 Watt 1% Resistor 2.0K Ohm 1/10 Watt 1% Resistor 2.2K Ohm 1/10 Watt 1% Resistor 3.3K Ohm 1/10 Watt 1% Resistor 4.7K Ohm 1/10 Watt 1% Resistor 10.0K Ohm 1/10 Watt 1% Resistor 12.0K Ohm 1/10 Watt 1% Resistor 12.1K Ohm 1/10 Watt 1% Resistor 20.0K Ohm 1/10 Watt 1% Resistor 33.0K Ohm 1/10 Watt 1% Resistor 100.0K Ohm 1/10 Watt 1% Resistor 0805 - 0805 Surface Mount Package 0 Ohm 1/8 Watt 1% Resistor 33 Ohm 1/8 Watt 1% Resistor 100 Ohm 1/8 Watt 1% Resistor 150 Ohm 1/8 Watt 1% Resistor 200 Ohm 1/8 Watt 1% Resistor 240 Ohm 1/8 Watt 1% Resistor 330 Ohm 1/8 Watt 1% Resistor 390 Ohm 1/8 Watt 1% Resistor 470 Ohm 1/8 Watt 1% Resistor 1.0K Ohm 1/8 Watt 1% Resistor 1.5K Ohm 1/8 Watt 1% Resistor 2.0K Ohm 1/8 Watt 1% Resistor 4.7K Ohm 1/8 Watt 1% Resistor 5.1K Ohm 1/8 Watt 1% Resistor 5.6K Ohm 1/8 Watt 1% Resistor 10.0K Ohm 1/8 Watt 1% Resistor 22.0K Ohm 1/8 Watt 1% Resistor 33.0K Ohm 1/8 Watt 1% Resistor 100K Ohm 1/8 Watt 1% Resistor 1206 - 1206 Surface Mount Package
R39 R40 RT1 RT2 = adafruit:R-US_: RESISTOR, American symbol
U1 = Texas Instruments_By_element14_Batch_1:LP2985A-33DBVTE4: 150-mA LOW-NOISE LOW-DROPOUT REGULATOR WITH SHUTDOWN; MPN: LP2985A-33DBVTE4; OC_FARNELL: 1053660; OC_NEWARK: 79K3928; PACKAGE: SOT-23-5; SUPPLIER: Texas Instruments
U2-U4 = LTC_By_element14_Batch_1:LT6005IGNPBF: Op Amps; MPN: LT6005IGN#PBF; OC_FARNELL: 1432099; OC_NEWARK: 57M8943; PACKAGE: SSOP-16; SUPPLIER: Linear Technology
U5 = microbuilder:MCP73833: Lithium-Polymer/Lithium-Ion Battery Charger [Part No.] Microchip MCP73833 MSOP10 (tube only): Digikey: MCP73833T-AMI/UN or MCP73833-FCI/UN-ND Mouser: 579-MCP73833-AMI/UN DFN10 (tape): Digikey: Note Chips ending in 'AMI' have no timer, and chips ending in 'FCI' have a 6-hour timer that will end the charge sequence after 6 horus regqrdless of current charge level.
U10 = SparkFun-DigitalIC:ATMEGA328_SMT: 32-Pin Atmega328 part Commonly used on Arduino compatible boards Available in QFP and QFN packages TQFP is IC-09069 QFN is non-stock; OC_NEWARK: unknown; PROD_ID: IC-09069
U15 = eric-custom:TLE2426IDR: TLE2426 Rail splitter
U$1-U$4 = eric-custom:SOIC8_INAMP: Generic single supply instrumentation amplifier for SO8 package. Based off of AD8221 inamp package
U$5 U$7 = eric-custom:LP2985A-50
U$6 = eric-custom:AD8462
U$8 = SPBT2632C2A:SPBT2632C2A
U$9 = eric-custom:LM27313: 1.6-MHz Boost Converter With 30-V Internal FET Switch in SOT-23
U$10 = eric-custom:MINI-USB-10033526-N3212LF: Amphenol 10033526-N3212LF
U$11 = eric-custom:JS102011SAQN: JS Series Sub-Miniature Slide Switches RIGHT ANGLE SURFACE MOUNT
U$12 = eric-custom:5-104074-1-CONNECTOR: 10 Positions Header, Shrouded Connector 0.050" (1.27mm) Through Hole, Right Angle Gold